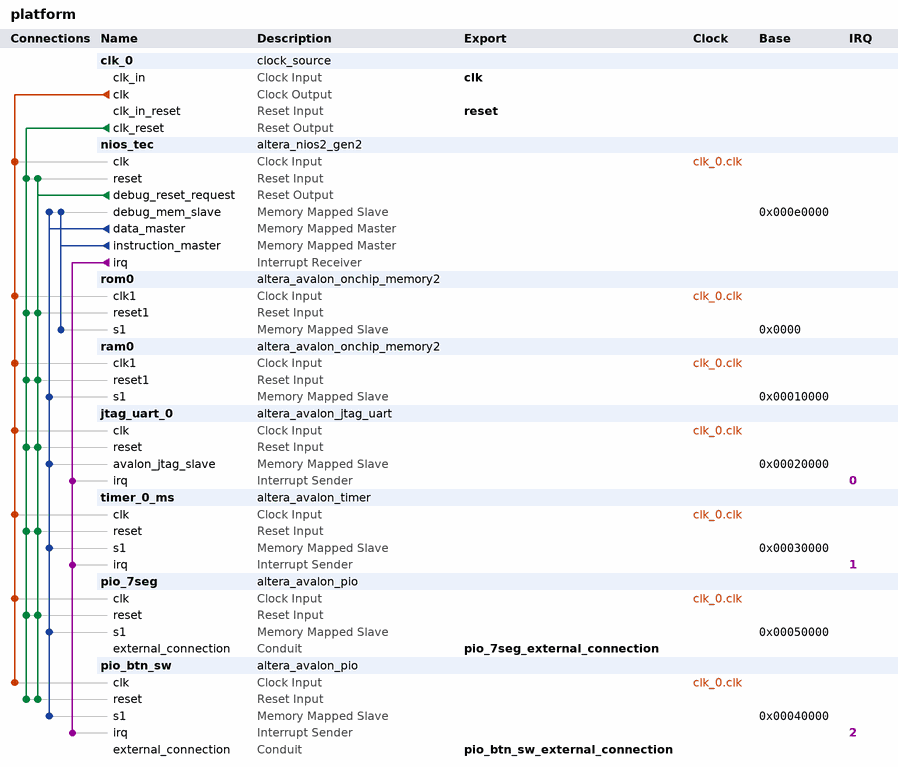
[diagram p0: system contents]
# Platform Designer (Qsys) system platform, Cyclone V 5CSEMA5F31C6
# Parameters at their usual value, and those the tool derives, are not listed.
package require -exact qsys 21.1
create_system platform
set_project_property DEVICE_FAMILY {Cyclone V}
set_project_property DEVICE 5CSEMA5F31C6

add_instance clk_0 clock_source 21.1
set_instance_parameter_value clk_0 clockFrequency 50000000

add_instance nios_tec altera_nios2_gen2 21.1
set_instance_parameter_value nios_tec dcache_size 2048
set_instance_parameter_value nios_tec exceptionSlave rom0.s1
set_instance_parameter_value nios_tec icache_size 4096
set_instance_parameter_value nios_tec impl Tiny
set_instance_parameter_value nios_tec resetSlave rom0.s1

add_instance rom0 altera_avalon_onchip_memory2 21.1
set_instance_parameter_value rom0 dataWidth 32
set_instance_parameter_value rom0 dualPort false
set_instance_parameter_value rom0 initMemContent true
set_instance_parameter_value rom0 initializationFileName onchip_mem.hex
set_instance_parameter_value rom0 memorySize 4096

add_instance ram0 altera_avalon_onchip_memory2 21.1
set_instance_parameter_value ram0 dataWidth 32
set_instance_parameter_value ram0 dualPort false
set_instance_parameter_value ram0 initMemContent true
set_instance_parameter_value ram0 initializationFileName onchip_mem.hex
set_instance_parameter_value ram0 memorySize 16384

add_instance jtag_uart_0 altera_avalon_jtag_uart 21.1
set_instance_parameter_value jtag_uart_0 simInteractiveOptions NO_INTERACTIVE_WINDOWS

add_instance timer_0_ms altera_avalon_timer 21.1
set_instance_parameter_value timer_0_ms fixedPeriod true
set_instance_parameter_value timer_0_ms period 1
set_instance_parameter_value timer_0_ms periodUnits MSEC
set_instance_parameter_value timer_0_ms snapshot false

add_instance pio_7seg altera_avalon_pio 21.1
set_instance_parameter_value pio_7seg bitModifyingOutReg true
set_instance_parameter_value pio_7seg direction Output
set_instance_parameter_value pio_7seg width 24

add_instance pio_btn_sw altera_avalon_pio 21.1
set_instance_parameter_value pio_btn_sw captureEdge true
set_instance_parameter_value pio_btn_sw direction Input
set_instance_parameter_value pio_btn_sw edgeType FALLING
set_instance_parameter_value pio_btn_sw generateIRQ true
set_instance_parameter_value pio_btn_sw irqType EDGE
set_instance_parameter_value pio_btn_sw simDoTestBenchWiring true
set_instance_parameter_value pio_btn_sw width 4

# connections
add_connection clk_0.clk jtag_uart_0.clk clock
add_connection clk_0.clk nios_tec.clk clock
add_connection clk_0.clk pio_7seg.clk clock
add_connection clk_0.clk pio_btn_sw.clk clock
add_connection clk_0.clk ram0.clk1 clock
add_connection clk_0.clk rom0.clk1 clock
add_connection clk_0.clk timer_0_ms.clk clock
add_connection clk_0.clk_reset jtag_uart_0.reset reset
add_connection clk_0.clk_reset nios_tec.reset reset
add_connection clk_0.clk_reset pio_7seg.reset reset
add_connection clk_0.clk_reset pio_btn_sw.reset reset
add_connection clk_0.clk_reset ram0.reset1 reset
add_connection clk_0.clk_reset rom0.reset1 reset
add_connection clk_0.clk_reset timer_0_ms.reset reset
add_connection nios_tec.debug_reset_request jtag_uart_0.reset reset
add_connection nios_tec.debug_reset_request nios_tec.reset reset
add_connection nios_tec.debug_reset_request pio_7seg.reset reset
add_connection nios_tec.debug_reset_request pio_btn_sw.reset reset
add_connection nios_tec.debug_reset_request ram0.reset1 reset
add_connection nios_tec.debug_reset_request rom0.reset1 reset
add_connection nios_tec.debug_reset_request timer_0_ms.reset reset
add_connection nios_tec.data_master jtag_uart_0.avalon_jtag_slave avalon
set_connection_parameter_value nios_tec.data_master/jtag_uart_0.avalon_jtag_slave baseAddress 0x00020000
add_connection nios_tec.data_master nios_tec.debug_mem_slave avalon
set_connection_parameter_value nios_tec.data_master/nios_tec.debug_mem_slave baseAddress 0x000e0000
add_connection nios_tec.data_master pio_7seg.s1 avalon
set_connection_parameter_value nios_tec.data_master/pio_7seg.s1 baseAddress 0x00050000
add_connection nios_tec.data_master pio_btn_sw.s1 avalon
set_connection_parameter_value nios_tec.data_master/pio_btn_sw.s1 baseAddress 0x00040000
add_connection nios_tec.data_master ram0.s1 avalon
set_connection_parameter_value nios_tec.data_master/ram0.s1 baseAddress 0x00010000
add_connection nios_tec.data_master timer_0_ms.s1 avalon
set_connection_parameter_value nios_tec.data_master/timer_0_ms.s1 baseAddress 0x00030000
add_connection nios_tec.instruction_master nios_tec.debug_mem_slave avalon
set_connection_parameter_value nios_tec.instruction_master/nios_tec.debug_mem_slave baseAddress 0x000e0000
add_connection nios_tec.instruction_master rom0.s1 avalon
set_connection_parameter_value nios_tec.instruction_master/rom0.s1 baseAddress 0x0000
add_connection nios_tec.irq jtag_uart_0.irq interrupt
set_connection_parameter_value nios_tec.irq/jtag_uart_0.irq irqNumber 0
add_connection nios_tec.irq pio_btn_sw.irq interrupt
set_connection_parameter_value nios_tec.irq/pio_btn_sw.irq irqNumber 2
add_connection nios_tec.irq timer_0_ms.irq interrupt
set_connection_parameter_value nios_tec.irq/timer_0_ms.irq irqNumber 1

# exported interfaces
add_interface clk clock sink
set_interface_property clk EXPORT_OF clk_0.clk_in
add_interface pio_7seg_external_connection conduit end
set_interface_property pio_7seg_external_connection EXPORT_OF pio_7seg.external_connection
add_interface pio_btn_sw_external_connection conduit end
set_interface_property pio_btn_sw_external_connection EXPORT_OF pio_btn_sw.external_connection
add_interface reset reset sink
set_interface_property reset EXPORT_OF clk_0.clk_in_reset

set_interconnect_requirement {$system} qsys_mm.clockCrossingAdapter HANDSHAKE
set_interconnect_requirement {$system} qsys_mm.enableEccProtection FALSE
set_interconnect_requirement {$system} qsys_mm.insertDefaultSlave FALSE
set_interconnect_requirement {$system} qsys_mm.maxAdditionalLatency 1

save_system platform.qsys
